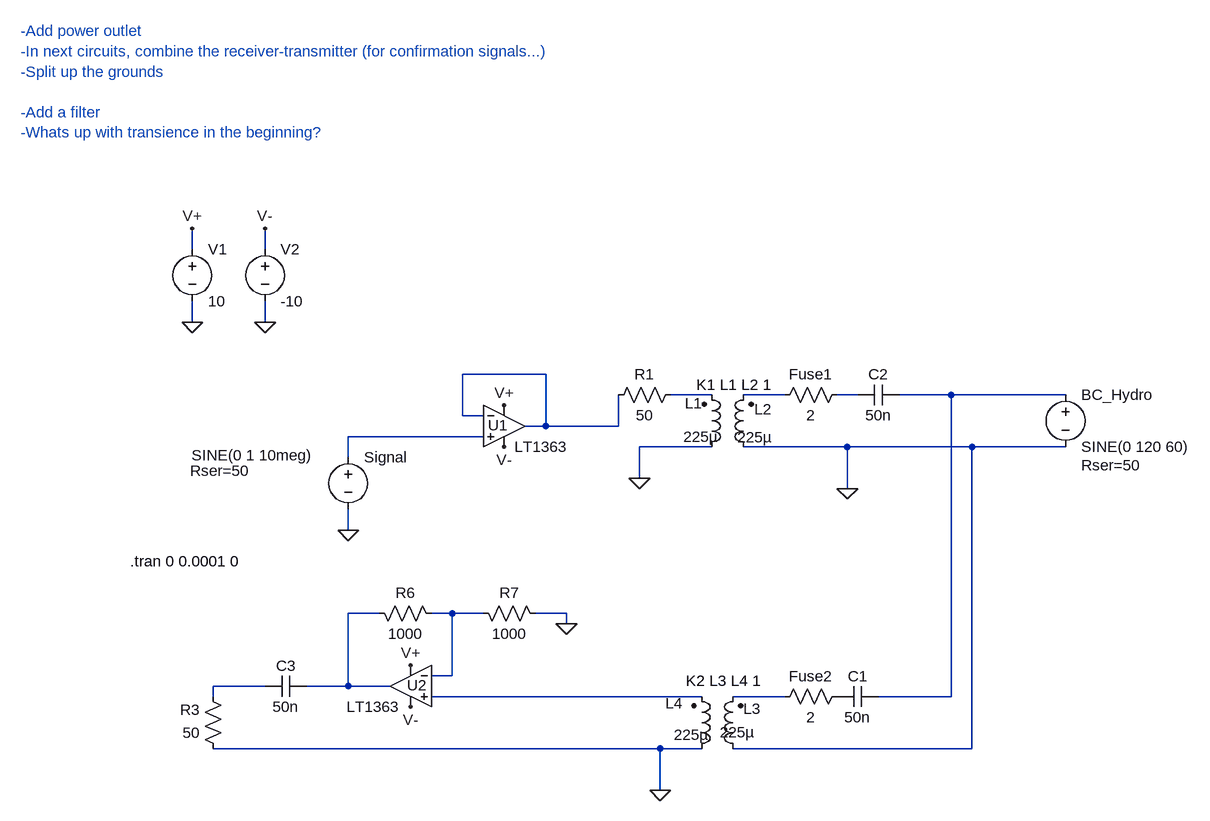
[diagram p0: schematic powerline_coupling_isolation1.1.asc]
powerline_coupling_isolation1.1.asc, the LTspice schematic file:
Version 4
SHEET 1 1236 708
WIRE -320 -144 -320 -176
WIRE -208 -144 -208 -176
WIRE -320 -32 -320 -64
WIRE -208 -32 -208 -64
WIRE 224 48 96 48
WIRE 480 80 416 80
WIRE 592 80 528 80
WIRE 704 80 672 80
WIRE 848 80 768 80
WIRE 1024 80 848 80
WIRE 96 112 96 48
WIRE 128 112 96 112
WIRE 224 128 224 48
WIRE 224 128 192 128
WIRE 336 128 336 80
WIRE 336 128 224 128
WIRE 128 144 -80 144
WIRE 480 160 368 160
WIRE 688 160 528 160
WIRE 880 160 688 160
WIRE 1024 160 880 160
WIRE -80 176 -80 144
WIRE 368 208 368 160
WIRE 688 224 688 160
WIRE -80 288 -80 256
WIRE -32 416 -80 416
WIRE 80 416 48 416
WIRE 128 416 80 416
WIRE 256 416 208 416
WIRE 256 432 256 416
WIRE 80 512 80 416
WIRE 80 512 48 512
WIRE -208 528 -288 528
WIRE -80 528 -80 416
WIRE -80 528 -144 528
WIRE -16 528 -80 528
WIRE -288 544 -288 528
WIRE 464 544 48 544
WIRE 592 544 512 544
WIRE 848 544 848 80
WIRE 848 544 736 544
WIRE 400 624 -288 624
WIRE 464 624 400 624
WIRE 880 624 880 160
WIRE 880 624 512 624
WIRE 400 688 400 624
FLAG -80 288 0
FLAG 688 224 0
FLAG 400 688 0
FLAG 368 208 0
FLAG -320 -32 0
FLAG -208 -32 0
FLAG -320 -176 V+
FLAG -208 -176 V-
FLAG 160 96 V+
FLAG 160 160 V-
FLAG 256 432 0
FLAG 16 496 V+
FLAG 16 560 V-
SYMBOL voltage -80 160 R0
WINDOW 3 -241 13 Left 2
WINDOW 123 0 0 Left 2
WINDOW 39 -243 37 Left 2
SYMATTR Value SINE(0 1 10meg)
SYMATTR SpiceLine Rser=50
SYMATTR InstName Signal
SYMBOL ind2 544 176 R180
WINDOW 0 -28 74 Left 2
WINDOW 3 -29 31 Left 2
SYMATTR InstName L2
SYMATTR Value 225µ
SYMATTR Type ind
SYMBOL ind2 464 176 M180
WINDOW 0 -26 83 Left 2
WINDOW 3 -28 32 Left 2
SYMATTR InstName L1
SYMATTR Value 225µ
SYMATTR Type ind
SYMBOL voltage 1024 64 R0
WINDOW 123 0 0 Left 2
WINDOW 39 24 124 Left 2
SYMATTR SpiceLine Rser=50
SYMATTR InstName BC_Hydro
SYMATTR Value SINE(0 120 60)
SYMBOL cap 768 64 R90
WINDOW 0 0 32 VBottom 2
WINDOW 3 32 32 VTop 2
SYMATTR InstName C2
SYMATTR Value 50n
SYMATTR SpiceLine V=250
SYMBOL ind2 528 640 R180
WINDOW 0 -27 77 Left 2
WINDOW 3 -18 41 Left 2
SYMATTR InstName L3
SYMATTR Value 225µ
SYMATTR Type ind
SYMBOL ind2 448 640 M180
WINDOW 0 -40 86 Left 2
WINDOW 3 -27 37 Left 2
SYMATTR InstName L4
SYMATTR Value 225µ
SYMATTR Type ind
SYMBOL cap 736 528 R90
WINDOW 0 0 32 VBottom 2
WINDOW 3 32 32 VTop 2
SYMATTR InstName C1
SYMATTR Value 50n
SYMBOL voltage -320 -160 R0
WINDOW 123 0 0 Left 2
WINDOW 39 0 0 Left 2
SYMATTR InstName V1
SYMATTR Value 10
SYMBOL voltage -208 -160 R0
WINDOW 123 0 0 Left 2
WINDOW 39 0 0 Left 2
SYMATTR InstName V2
SYMATTR Value -10
SYMBOL Opamps\\LT1363 160 64 R0
WINDOW 0 -25 63 Left 2
SYMATTR InstName U1
SYMBOL res 432 64 R90
WINDOW 0 0 56 VBottom 2
WINDOW 3 32 56 VTop 2
SYMATTR InstName R1
SYMATTR Value 50
SYMBOL res -48 400 M90
WINDOW 0 0 56 VBottom 2
WINDOW 3 32 56 VTop 2
SYMATTR InstName R6
SYMATTR Value 1000
SYMBOL res 112 400 M90
WINDOW 0 0 56 VBottom 2
WINDOW 3 32 56 VTop 2
SYMATTR InstName R7
SYMATTR Value 1000
SYMBOL Opamps\\LT1363 16 464 M0
WINDOW 0 -25 63 Left 2
SYMATTR InstName U2
SYMBOL res -272 640 R180
WINDOW 0 36 76 Left 2
WINDOW 3 36 40 Left 2
SYMATTR InstName R3
SYMATTR Value 50
SYMBOL res 688 528 R90
WINDOW 0 0 56 VBottom 2
WINDOW 3 32 56 VTop 2
SYMATTR InstName Fuse2
SYMATTR Value 2
SYMBOL res 688 64 R90
WINDOW 0 0 56 VBottom 2
WINDOW 3 32 56 VTop 2
SYMATTR InstName Fuse1
SYMATTR Value 2
SYMBOL cap -144 512 R90
WINDOW 0 0 32 VBottom 2
WINDOW 3 32 32 VTop 2
SYMATTR InstName C3
SYMATTR Value 50n
TEXT -416 336 Left 2 !.tran 0 0.0001 0
TEXT 456 64 Left 2 !K1 L1 L2 1
TEXT 440 520 Left 2 !K2 L3 L4 1
TEXT -584 -480 Left 2 ;-Add power outlet\n-In next circuits, combine the receiver-transmitter (for confirmation signals...)\n-Split up the grounds\n \n-Add a filter\n-Whats up with transience in the beginning?

The netlist it stands for:
* powerline_coupling_isolation1.1.asc
V§Signal N006 0 SINE(0 1 10meg) Rser=50
L2 0 N003 225µ
L1 0 N002 225µ
V§BC_Hydro N005 0 SINE(0 120 60) Rser=50
C2 N005 N004 50n V=250
L3 0 N011 225µ
L4 0 N010 225µ
C1 N005 P001 50n
V1 V+ 0 10
V2 V- 0 -10
XU1 N006 N001 V+ V- N001 LT1363  ; pins In+ In- V+ V- OUT
R1 N002 N001 50
R6 N007 N008 1000
R7 N008 0 1000
XU2 N010 N008 V+ V- N007 LT1363  ; pins In+ In- V+ V- OUT
R3 0 N009 50
R§Fuse2 P001 N011 2
R§Fuse1 N004 N003 2
C3 N007 N009 50n
.tran 0 0.0001 0
K1 L1 L2 1
K2 L3 L4 1
* -Add power outlet
* -In next circuits, combine the receiver-transmitter (for confirmation signals...)
* -Split up the grounds
* -Add a filter
* -Whats up with transience in the beginning?
.lib LT1363.sub
.backanno
.end